# Altium schematic sheet flexi_ethernet_w5500.SchDoc: RP2040 CNC
size C; Author: AM; CompanyName: Expatria Technologies; DrawnBy: A.Marles; Engineer: AM; Organization: Expatria Technolgoies; Address1: Schematic; DocumentNumber: 2; SheetNumber: 2; SheetTotal: 5
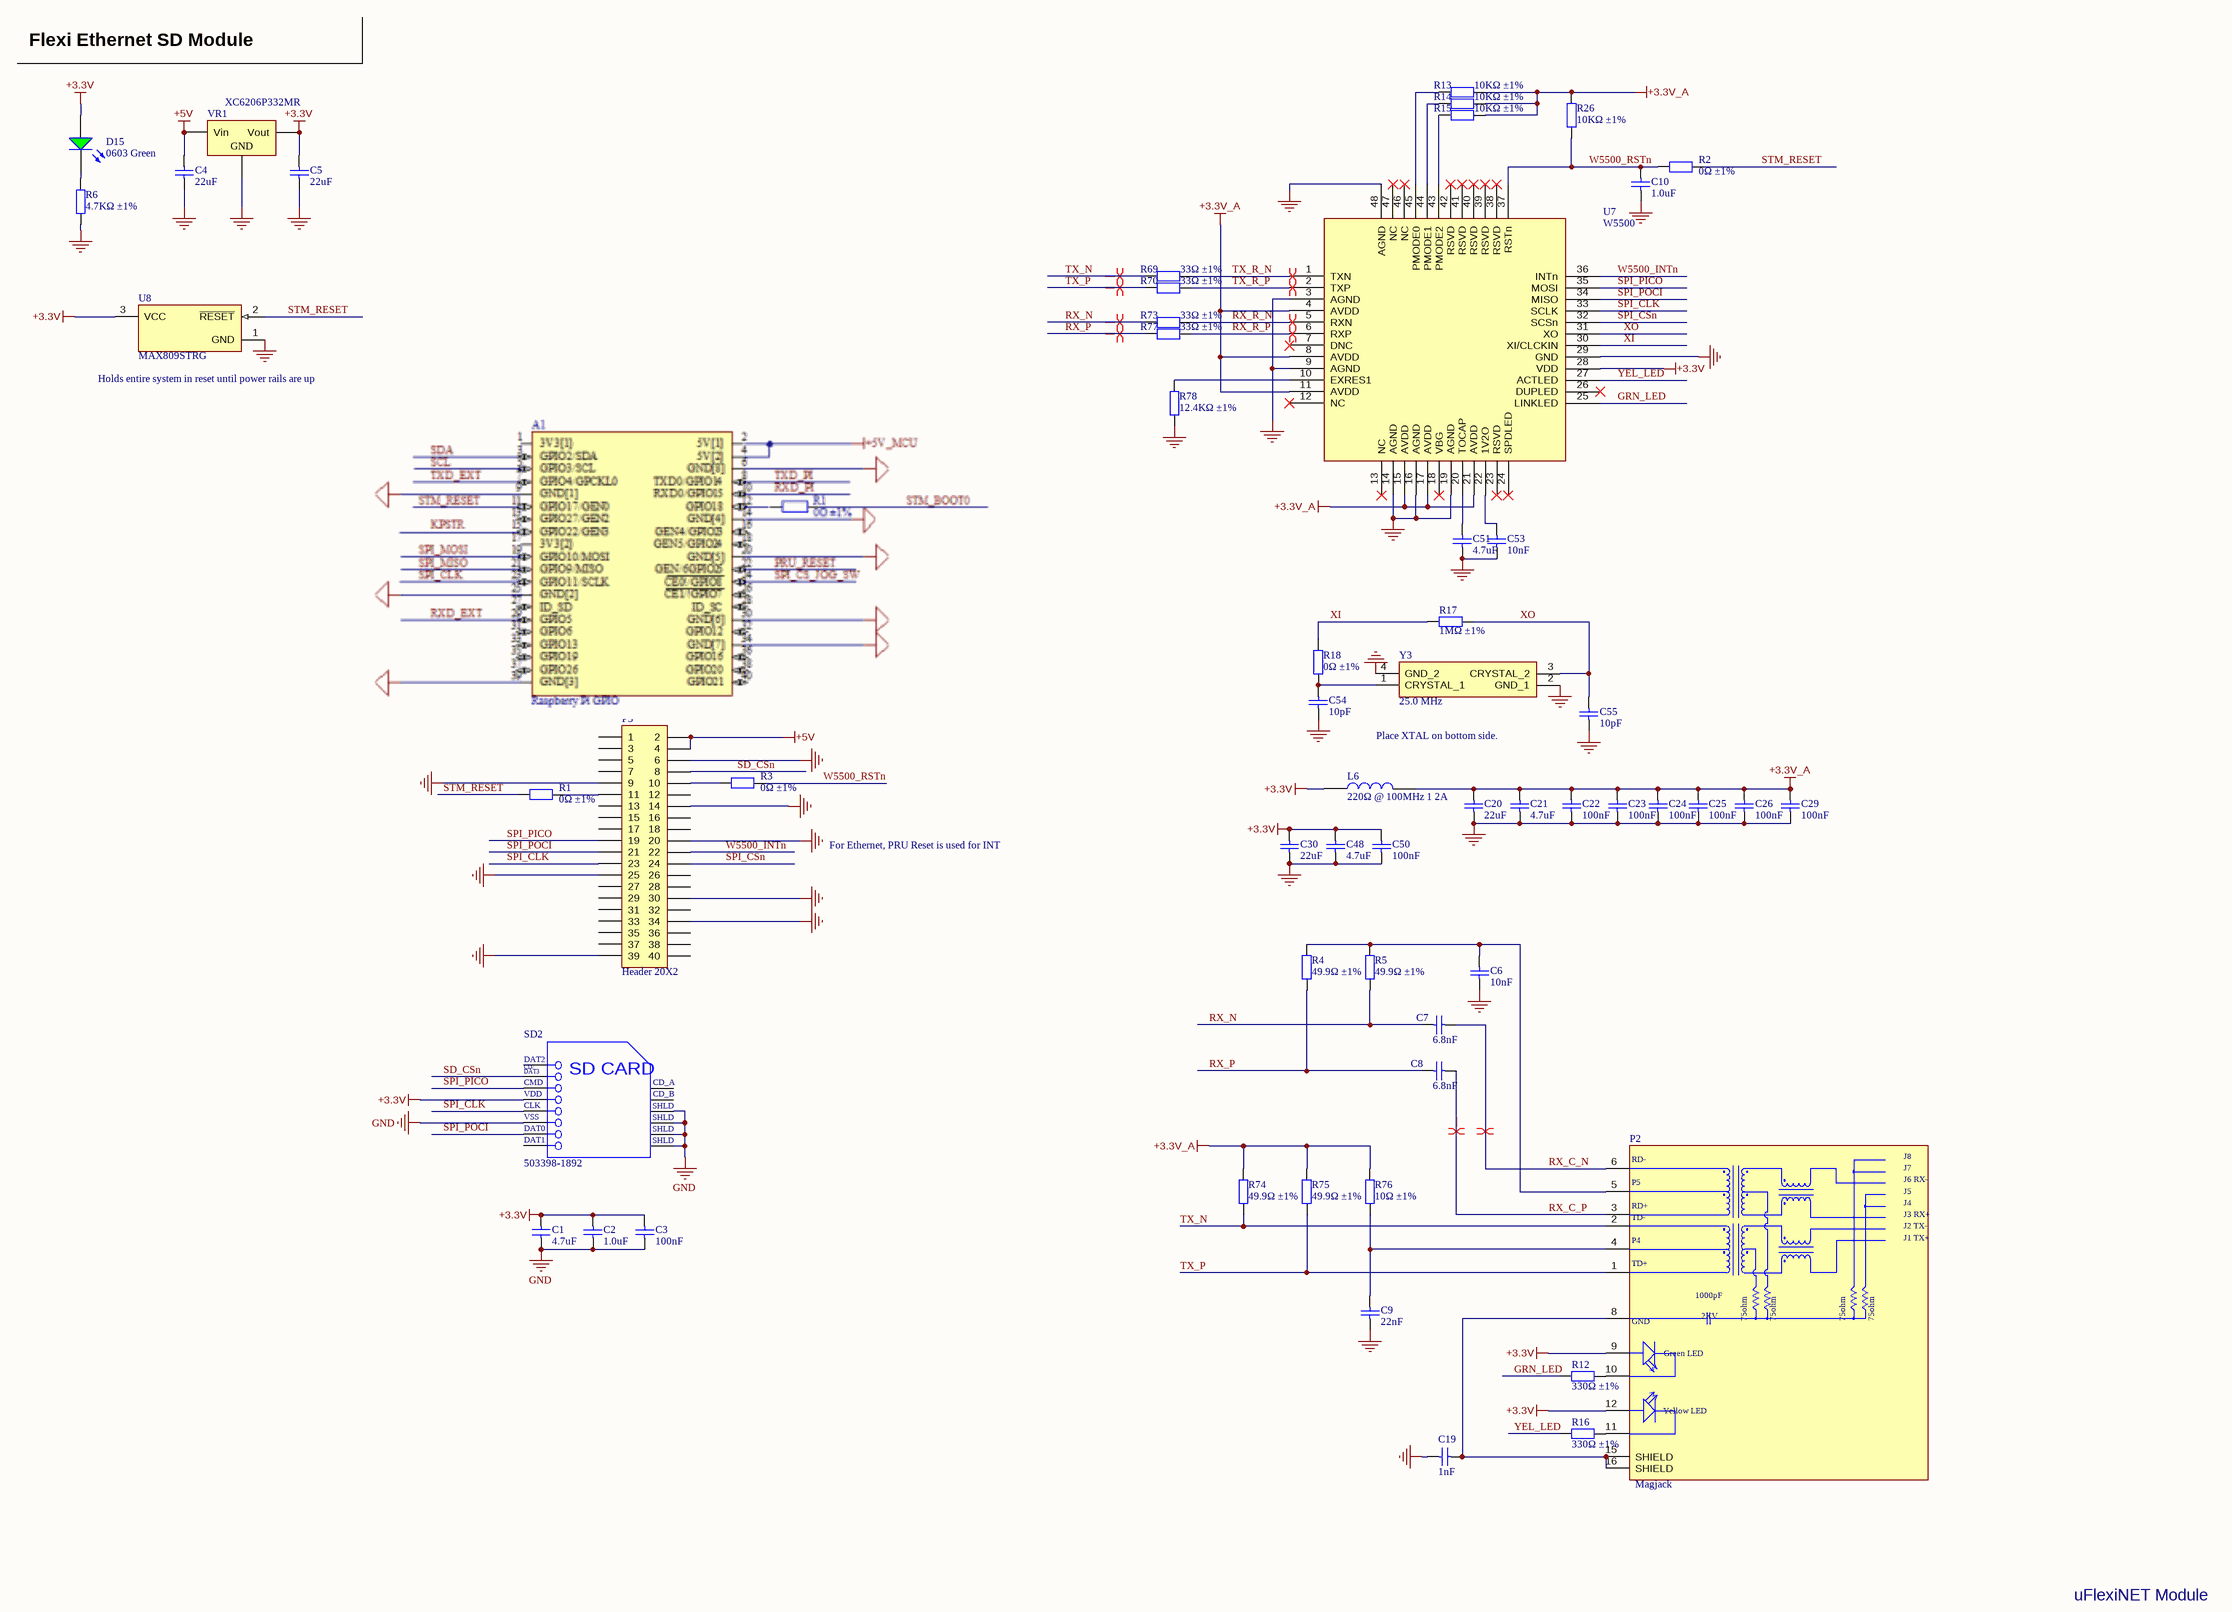
[diagram p0: flexi_ethernet_w5500.SchDoc]

## Parts
C1  4.7uF  [0603_C]
C2  1.0uF  [0402_C]
C3  100nF  [0402_C]
C4  22uF  [0805_C]
C5  22uF  [0805_C]
C6  10nF  [0402_C]
C7  6.8nF  [0402_C]
C8  6.8nF  [0402_C]
C9  22nF  [0402_C]
C10  1.0uF  [0402_C]
C19  1nF  [1206_C]
C20  22uF  [0805_C]
C21  4.7uF  [0603_C]
C22  100nF  [0402_C]
C23  100nF  [0402_C]
C24  100nF  [0402_C]
C25  100nF  [0402_C]
C26  100nF  [0402_C]
C29  100nF  [0402_C]
C30  22uF  [0805_C]
C48  4.7uF  [0603_C]
C50  100nF  [0402_C]
C51  4.7uF  [0402_C]
C53  10nF  [0402_C]
C54  10pF  [0402_C]
C55  10pF  [0402_C]
D15  0603 Green  [0603_LED_S1]
L6  220Ω @ 100MHz 1 2A  [0805_C]
P2  Magjack  [HANRUN_HR911105A]
P3  Header 20X2  [HDR2X20_2.54_180]
R1  0Ω ±1%  [0402_R]
R2  0Ω ±1%  [0402_R]
R3  0Ω ±1%  [0402_R]
R4  49.9Ω ±1%  [0402_R]
R5  49.9Ω ±1%  [0402_R]
R6  4.7KΩ ±1%  [0402_R]
R12  330Ω ±1%  [0402_R]
R13  10KΩ ±1%  [0402_R]
R14  10KΩ ±1%  [0402_R]
R15  10KΩ ±1%  [0402_R]
R16  330Ω ±1%  [0402_R]
R17  1MΩ ±1%  [0402_R]
R18  0Ω ±1%  [0402_R]
R26  10KΩ ±1%  [0402_R]
R69  33Ω ±1%  [0402_R]
R70  33Ω ±1%  [0402_R]
R73  33Ω ±1%  [0402_R]
R74  49.9Ω ±1%  [0402_R]
R75  49.9Ω ±1%  [0402_R]
R76  10Ω ±1%  [0402_R]
R77  33Ω ±1%  [0402_R]
R78  12.4KΩ ±1%  [0603_R]
SD2  503398-1892  [MOLX-503398-1892_V]
U7  W5500  [LQFP-48_7x7x05P]
U8  MAX809STRG  [FP-318-08-MFG]
VR1  XC6206P332MR  [SOT-23-3L]
Y3  25.0 MHz  [YSX321SL]

## Nets
+3.3V: C1.2 C2.2 C3.2 C5.2 C30.2 C48.2 C50.2 D15.A L6.1 P2.9(GA) P2.12(YA) SD2.4(VDD) U7.28(VDD) U8.3(VCC) VR1.2(Vout)
+3.3V_A: C20.2 C21.2 C22.2 C23.2 C24.2 C25.2 C26.2 C29.2 L6.2 R13.1 R14.1 R15.1 R26.1 R74.1 R75.1 R76.1 U7.4(AVDD) U7.8(AVDD) U7.11(AVDD) U7.15(AVDD) U7.17(AVDD) U7.21(AVDD)
+5V: C4.2 P3.2 P3.4 VR1.3(Vin)
GND: C1.1 C2.1 C3.1 C4.1 C5.1 C6.1 C9.1 C10.1 C19.1 C20.1 C21.1 C22.1 C23.1 C24.1 C25.1 C26.1 C29.1 C30.1 C48.1 C50.1 C51.1 C53.1 C54.1 C55.1 P3.6 P3.9 P3.14 P3.20 P3.25 P3.30 P3.34 P3.39 R6.1 R78.1 SD2.6(VSS) SD2.11(SHLD) SD2.12(SHLD) SD2.13(SHLD) SD2.14(SHLD) U7.3(AGND) U7.9(AGND) U7.14(AGND) U7.16(AGND) U7.19(AGND) U7.29(GND) U7.48(AGND) U8.1(GND) VR1.1(GND) Y3.2(GND_1) Y3.4(GND_2)
GRN_LED: R12.1 U7.25(LINKLED)
RX_C_N: C7.1 P2.6(RD-)
RX_C_P: C8.1 P2.3(RD+)
RX_N: C7.2 R5.2 R73.1
RX_P: C8.2 R4.2 R77.1
RX_R_N: R73.2 U7.5(RXN)
RX_R_P: R77.2 U7.6(RXP)
SD_CSn: P3.8 SD2.2(CD/DAT3)
SPI_CLK: P3.23 SD2.5(CLK) U7.33(SCLK)
SPI_CSn: P3.24 U7.32(SCSn)
SPI_PICO: P3.19 SD2.3(CMD) U7.35(MOSI)
SPI_POCI: P3.21 SD2.7(DAT0) U7.34(MISO)
STM_RESET: R1.2 R2.1 U8.2(~{RESET})
TX_N: P2.2(TD-) R69.1 R74.2
TX_P: P2.1(TD+) R70.1 R75.2
TX_R_N: R69.2 U7.1(TXN)
TX_R_P: R70.2 U7.2(TXP)
W5500_INTn: P3.22 U7.36(INTn)
W5500_RSTn: C10.2 R2.2 R3.1 R26.2 U7.37(RSTn)
XI: R17.1 R18.1 U7.30(XI/CLCKIN)
XO: C55.2 R17.2 U7.31(XO) Y3.3(CRYSTAL_2)
YEL_LED: R16.1 U7.27(ACTLED)
NetC6_2: C6.2 P2.5(P5) R4.1 R5.1
NetC9_2: C9.2 P2.4(P4) R76.2
NetC19_2: C19.2 P2.8(GND) P2.15(SHIELD) P2.16(SHIELD)
NetC51_2: C51.2 U7.20(TOCAP)
NetC53_2: C53.2 U7.22(1V2O)
NetC54_2: C54.2 R18.2 Y3.1(CRYSTAL_1)
NetD15_K: D15.K R6.2
NetP2_10: P2.10(GC) R12.2
NetP2_11: P2.11(YC) R16.2
NetP3_10: P3.10 R3.2
NetP3_11: P3.11 R1.1
NetR13_2: R13.2 U7.45(PMODE0)
NetR14_2: R14.2 U7.44(PMODE1)
NetR15_2: R15.2 U7.43(PMODE2)
NetR78_2: R78.2 U7.10(EXRES1)

Not connected (* = marked no-connect by the designer): P3 1 3 5 7 12 13 15 16 17 18 26 27 28 29 31 32 33 35 36 37 38 40; SD2 1(DAT2) 8(DAT1) 9(CD_A) 10(CD_B); U7 7(DNC)* 12(NC)* 13(NC)* 18(VBG)* 23(RSVD)* 24(SPDLED)* 26(DUPLED)* 38(RSVD)* 39(RSVD)* 40(RSVD)* 41(RSVD)* 42(RSVD)* 46(NC)* 47(NC)*

## Layout directives
differential pair: RX_C_N, RX_C_P, RX_N, RX_P, RX_R_N, RX_R_P, TX_N, TX_P, TX_R_N, TX_R_P

## Notes on the sheet
- Flexi Ethernet SD Module
- (near U8) Holds entire system in reset until power rails are up
- Place XTAL on bottom side.
- For Ethernet, PRU Reset is used for INT
- uFlexiNET Module
- Expatria Technologies
- SHEET
- PROJECT
- REV
- 1136 Glade Court
- Port Coquitlam, BC V3B 1R5
- EMAIL: INFO@EXPATRIA.CA
- SIZE
- ENGR
- C
- MODIFIED
- DOCUMENT
- /
- Copyright Expatria Technologies 2023. This document describes Open Hardware and is licensed under the CERN-OHL-S v2. No warranty is implied or expressed.
- (in symbol CMP-2000-05621-1) CD/; DAT3; SD CARD
- (in symbol HR911105A) J8; J7; J6 RX-; J5; J4; J3 RX+; J2 TX-; J1 TX+; 1000pF; 2KV; 75ohm; Green LED; Yellow LED

## Library data of the parts
C1 C21 C48 = 0603 4.7uF (475) 10% 16V: Chip capacitors; Manufacturer: Samsung Electro-Mechanics; PartNumber: CL10A475KO8NNNC; Tolerance: 10%; Voltage: 16V; ComponentLink1Description: Supplier link; ComponentLink1URL: http://www.szlcsc.com/product/details_20375.html; Package: 0603; SuppliersPartNumber: C19666; Capacitance: 4.7uF
  C1: Supplier: LCSC; Manufacturer Part Number: CL10A475KO8NNNC
  C21 C48: Supplier: LC
C2 C10 = 0402 1.0uF (105) 10% 25V: Chip capacitor; Manufacturer: Samsung Electro-Mechanics; PartNumber: CL05A105KA5NQNC; Capacitance: 1uF; Tolerance: 10%; Voltage: 25V; ComponentLink1Description: Supplier link; ComponentLink1URL: http://www.szlcsc.com/product/details_53938.html; Package: 0402; Supplier: LC; SuppliersPartNumber: C52923
C3 C22-C26 C29 C50 = 0402 100nF (104) 10% 16V: Chip capacitors; Manufacturer: Samsung Electro-Mechanics; PartNumber: CL05B104KO5NNNC; Tolerance: 10%; Voltage: 16V; ComponentLink1Description: Supplier link; ComponentLink1URL: http://www.szlcsc.com/product/details_1877.html; Package: 0402; Supplier: LC; SuppliersPartNumber: C1525; Capacitance: 100nF
C4 C5 C20 C30 = 0805 22uF (226) 20% 25V: Chip capacitors; Manufacturer: Samsung Electro-Mechanics; PartNumber: CL21A226MAQNNNE; Tolerance: 20%; Voltage: 25V; Package: 0805; Supplier: LC; SuppliersPartNumber: C2922481; Capacitance: 22uF; ComponentLink1Description: Supplier link; ComponentLink1URL: http://www.szlcsc.com/product/details_46786.html
C6 C53 = 0402 10nF (103) 10% 50V: Chip capacitors; Manufacturer: Samsung Electro-Mechanics; PartNumber: CL05B103KB5NNNC; Tolerance: 10%; Voltage: 50V; ComponentLink1Description: Supplier link; ComponentLink1URL: http://www.szlcsc.com/product/details_15869.html; Package: 0402; Supplier: LC; SuppliersPartNumber: C15195; Capacitance: 10nF
C7 C8 = 0402 6.8nF (682) 10% 50V: Chip capacitors; Manufacturer: Guangdong Fenghua Advanced Tech; PartNumber: 0402B682K500NT; Tolerance: 10%; Voltage: 50V; ComponentLink1Description: Supplier link; ComponentLink1URL: http://www.szlcsc.com/product/details_1894.html; Package: 0402; Supplier: LC; SuppliersPartNumber: C1542; Capacitance: 6.8nF
C9 = 0402 22nF (223) 10% 50V: Chip capacitors; Manufacturer: Guangdong Fenghua Advanced Tech; PartNumber: 0402B223K500NT; Tolerance: 10%; Voltage: 50V; ComponentLink1Description: Supplier link; ComponentLink1URL: http://www.szlcsc.com/product/details_1884.html; Package: 0402; Supplier: LC; SuppliersPartNumber: C1532; Capacitance: 22nF
C19 = 1206 1nF (102) 10% 500V: Chip capacitors; Manufacturer: Samsung Electro-Mechanics; PartNumber: CL31B102KGFNNNE; Tolerance: 10%; Voltage: 500V; ComponentLink1Description: Supplier link; ComponentLink1URL: http://www.szlcsc.com/product/details_36187.html; Package: 1206; Supplier: LC; SuppliersPartNumber: C35216; Capacitance: 1nF
C51 = 0402 4.7uF (475) 20% 10V: Chip capacitor; Manufacturer: Samsung Electro-Mechanics; PartNumber: CL05A475MP5NRNC; Tolerance: 20%; Voltage: 10V; ComponentLink1Description: Supplier link; ComponentLink1URL: http://www.szlcsc.com/product/details_24469.html; Package: 0402; Supplier: LC; SuppliersPartNumber: C23733; Capacitance: 4.7uF
C54 C55 = 0402 10pF (100) 5% 50V: Chip capacitors; Manufacturer: Samsung Electro-Mechanics; PartNumber: CL05C100JB5NNNC; Tolerance: 5%; Voltage: 50V; ComponentLink1Description: Supplier link; ComponentLink1URL: http://www.szlcsc.com/product/details_33914.html; Package: 0402; Supplier: LC; SuppliersPartNumber: C32949; Capacitance: 10pF
D15 = 0603 LED Green: LED; ComponentLink1Description: 供应商链接; ComponentLink1URL: http://www.szlcsc.com/product/details_73152.html; Package: 0603; Supplier: LC; SuppliersPartNumber: C72043; Color: Green
L6 = 0402 220R@100Mhz 0.1A: 220Ω @ 100MHz 1 2A 150mΩ 0805 Ferrite Beads ROHS; Notepad: *; Package: 0805; Supplier: LC; SuppliersPartNumber: C139188
P2 = HR911105A: HR911105A Ethernet Interface Arduino Platform Evaluation Expansion Board; MF: DFRobot; SuppliersPartNumber: C163507; Package: None; Availability: Unavailable; MP: HR911105A; Value: *; Price: None
P3 = Header 20X2: Header, 20-Pin, Dual row; LatestRevisionDate: 17-Jul-2002; LatestRevisionNote: Re-released for DXP Platform.; Publisher: Altium Limited; SuppliersPartNumber: C124383
R1-R3 R18 = 0402 0R (0R0) 1%: Chip resistor; Manufacturer: Uniroyal Elec; PartNumber: 0402WGF0000TCE; Power: 1/16W; ComponentLink1Description: Supplier link; ComponentLink1URL: http://www.szlcsc.com/product/details_17853.html; Package: 0402; Supplier: LC; SuppliersPartNumber: C17168; Resistance: 0Ω; Tolerance: 1%
R4 R5 R74 R75 = 0402 49.9R (49R9) 1%: Chip resistor; Manufacturer: Uniroyal Elec; PartNumber: 0402WGF499JTCE; Power: 1/16W; ComponentLink1Description: Supplier link; ComponentLink1URL: http://www.szlcsc.com/product/details_25863.html; Package: 0402; Supplier: LC; SuppliersPartNumber: C25120; Resistance: 49.9Ω; Tolerance: 1%
R6 = 0402 4.7K (4701) 1%: Chip resistor; Manufacturer: Uniroyal Elec; PartNumber: 0402WGF4701TCE; Power: 1/16W; ComponentLink1Description: Supplier link; ComponentLink1URL: http://www.szlcsc.com/product/details_26643.html; Package: 0402; Supplier: LC; SuppliersPartNumber: C25900; Resistance: 4.7KΩ; Tolerance: 1%
R12 R16 = 0402 330R (3300) 1%: Chip resistor; Manufacturer: Uniroyal Elec; PartNumber: 0402WGF3300TCE; Power: 1/16W; ComponentLink1Description: Supplier link; ComponentLink1URL: http://www.szlcsc.com/product/details_25847.html; Package: 0402; Supplier: LC; SuppliersPartNumber: C25104; Resistance: 330Ω; Tolerance: 1%
R13-R15 R26 = 0402 10K (1002) 1%: Chip resistor; Manufacturer: Uniroyal Elec; PartNumber: 0402WGF1002TCE; Power: 1/16W; ComponentLink1Description: Supplier link; ComponentLink1URL: http://www.szlcsc.com/product/details_26487.html; Package: 0402; Supplier: LC; SuppliersPartNumber: C25744; Resistance: 10KΩ; Tolerance: 1%
R17 = 0402 1M (1004) 1%: Chip resistor; Manufacturer: Uniroyal Elec; PartNumber: 0402WGF1004TCE; Power: 1/16W; ComponentLink1Description: Supplier link; ComponentLink1URL: http://www.szlcsc.com/product/details_26826.html; Package: 0402; Supplier: LC; SuppliersPartNumber: C26083; Resistance: 1MΩ; Tolerance: 1%
R69 R70 R73 R77 = 0402 33R (33R0) 1%: Chip resistor; Manufacturer: Uniroyal Elec; PartNumber: 0402WGF330JTCE; Power: 1/16W; ComponentLink1Description: Supplier link; ComponentLink1URL: http://www.szlcsc.com/product/details_25848.html; Package: 0402; Supplier: LC; SuppliersPartNumber: C25105; Resistance: 33Ω; Tolerance: 1%
R76 = 0402 10R (10R0) 1%: Chip resistor; Manufacturer: Uniroyal Elec; PartNumber: 0402WGF100JTCE; Power: 1/16W; ComponentLink1Description: Supplier link; ComponentLink1URL: http://www.szlcsc.com/product/details_25820.html; Package: 0402; Supplier: LC; SuppliersPartNumber: C25077; Resistance: 10Ω; Tolerance: 1%
R78 = 0603 10K (1002) 1%: Chip resistor; Manufacturer: Uniroyal Elec; PartNumber: 0603WAF1242T5E; Power: 1/10W; Resistance: 12.4K; ComponentLink1Description: Supplier link; ComponentLink1URL: http://www.szlcsc.com/product/details_26547.html; Package: 0603; Supplier: LC; SuppliersPartNumber: C22865; Tolerance: 1%
SD2 = CMP-2000-05621-1: Micro SD Connector, Pitch 1.1 mm, 8 Position, Height 1.4 mm, -25 to 85 degC, RoHS, Tape and Reel; Manufacturer: Molex; Voltage Rating: 10VAC/DC; Manufacturer URL: http://www.molex.com/; Package Reference: 503398-1892; Packaging: Reel; RoHS: Details; Brand: Molex; Series: 503398; SuppliersPartNumber: C428492
U7 = W5500_[C32843]: Ethernet Controllers 2.97V ~ 3.63V 10/100 Base-T/TX PHY SPI LQFP-48_7x7x05P Ethernet ICs ROHS; ComponentLink1Description: 供应商链接; ComponentLink1URL: http://www.szlcsc.com/product/details_33808.html; Package: LQFP-48_7x7x05P; Supplier: LC; SuppliersPartNumber: C32843
U8 = CMP-07130-000007-1: IC MPU SUPERVISORY 2.93V SOT23; Manufacturer: ON SEMICONDUCTOR; Number Of Outputs: 1; Nominal Supply Current: 0.5-0.8uA; Min Supply Voltage: 1V; Max Junction Temp: +125°C; Max Supply Voltage: 5.5V; Reset Timeout: 10us; Output Current: 20mA; Output Voltage: 0.3V; Reset Type: Active Low; Standoff Height: 0.01mm; Octopart: https://octopart.com/max809strg-on+semiconductor-509853; Category: IC; Temperature: -40°C to +125°C; Temperature Range Low: -40°C; ComponentLink2URL: https://www.onsemi.cn/PowerSolutions/document/MAX809S-D.PDF; Device Class L1: Integrated Circuits (ICs); Automotive: No; Package: 318-08; Device Class L2: Power Management ICs; RoHS: TRUE; Height: 1.11mm; Digikey Description: IC MPU SUPERVISORY 2.93V SOT23; Mouser Description: Supervisory Circuits 2.93V uP Reset; ComponentLink2Description: Datasheet; Manufacturer Part Number: MAX809STRG; Temperature Range High: +125°C; Number Of Rails Monitored: 1; Threshold Voltage: 2.93V; Footprint Url: https://www.onsemi.com/pub/Collateral/318-08.PDF; Device Class L3: Voltage Supervisors; Lead Free: Yes; SuppliersPartNumber: C9965
VR1 = SOT-23 XC6206P332MR: 200mA 680mV@(100mA) Fixed 3.3V~3.3V Positive 1 6V SOT-23-3L Linear Voltage Regulators (LDO) ROHS; ComponentLink1Description: 供应商链接; ComponentLink1URL: http://www.szlcsc.com/product/details_5896.html; Package: SOT-23; Supplier: LC; SuppliersPartNumber: C5446
Y3 = YSX321SL: Crystal or Oscillator; Manufacturer_Name: Yangxing Tech; Manufacturer_Part_Number: X322525MSB4SI; Height: 0.8mm; SuppliersPartNumber: C13740